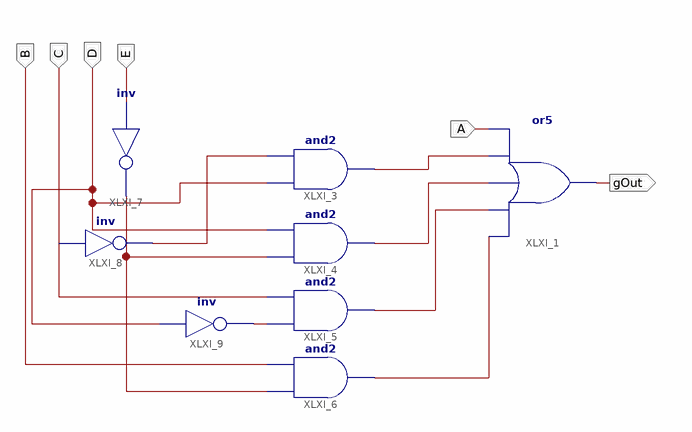
[diagram p0: schematic sheet 1]
// Xilinx ISE schematic g.sch (xa9500xl) as structural Verilog: 8 symbols, 6 ports
module g (
  input  A,
  input  B,
  input  C,
  input  D,
  input  E,
  output gOut
);

  wire XLXN_3, XLXN_4, XLXN_5, XLXN_6, XLXN_11, XLXN_15, XLXN_16;

  or XLXI_1 (gOut, XLXN_6, XLXN_5, XLXN_4, XLXN_3, A);
  and XLXI_3 (XLXN_3, D, XLXN_15);
  and XLXI_4 (XLXN_4, XLXN_11, D);
  and XLXI_5 (XLXN_5, XLXN_16, C);
  and XLXI_6 (XLXN_6, XLXN_11, B);
  not XLXI_7 (XLXN_11, E);
  not XLXI_8 (XLXN_15, C);
  not XLXI_9 (XLXN_16, D);
endmodule
